# EAGLE design AOXIM_V1.1 (EAGLE 8.7.0)
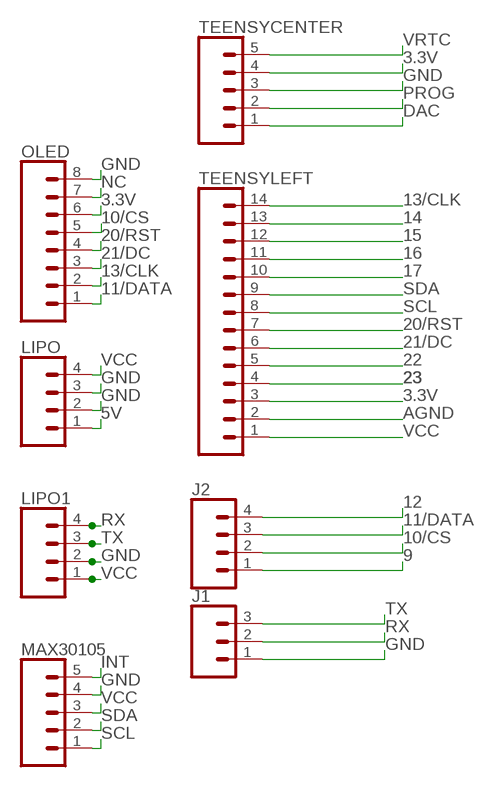
[diagram p0: schematic, sheet 1]

## Parts
J1  CONN_03  [1X03]
J2  CONN_04  [1X04]
LIPO  CONN_04  [1X04]
LIPO1  CONN_04  [1X04]
MAX30105  CONN_05  [1X05]
OLED  CONN_08"  [1X08]
TEENSYCENTER  CONN_05  [1X05]
TEENSYLEFT  CONN_14  [1X14]

## Nets
3.3V: OLED.6 TEENSYCENTER.4 TEENSYLEFT.3
5V: LIPO.1
9: J2.1
10/CS: J2.2 OLED.5
11/DATA: J2.3 OLED.1
12: J2.4
13/CLK: OLED.2 TEENSYLEFT.14
14: TEENSYLEFT.13
15: TEENSYLEFT.12
16: TEENSYLEFT.11
17: TEENSYLEFT.10
20/RST: OLED.4 TEENSYLEFT.7
21/DC: OLED.3 TEENSYLEFT.6
22: TEENSYLEFT.5
23: TEENSYLEFT.4
AGND: TEENSYLEFT.2
DAC: TEENSYCENTER.1
GND: J1.1 LIPO1.2 LIPO.2 LIPO.3 MAX30105.4 OLED.8 TEENSYCENTER.3
INT: MAX30105.5
NC: OLED.7
PROG: TEENSYCENTER.2
RX: J1.2 LIPO1.4
SCL: MAX30105.1 TEENSYLEFT.8
SDA: MAX30105.2 TEENSYLEFT.9
TX: J1.3 LIPO1.3
VCC: LIPO1.1 LIPO.4 MAX30105.3 TEENSYLEFT.1
VRTC: TEENSYCENTER.5

## Library data of the parts
J1 = SparkFun-Connectors:CONN_03: Multi connection point. Often used as Generic Header-pin footprint for 0.1 inch spaced/style header connections On any of the 0.1 inch spaced packages, you can populate with these: Break Away Headers - Straight <https://www.sparkfun.com/products/116> (PRT-00116) Break Away Male Headers - Right Angle <https://www.sparkfun.com/products/553> (PRT-00553) Female Headers <https://www.sparkfun.com/products/115> (PRT-00115) Break Away Headers - Machine Pin <https://www.sparkfun.com/products/117> (PRT-00117) Break Away Female Headers - Swiss Machine Pin <https://www.sparkfun.com/products/743> (PRT-00743) Stackable Header - 3 Pin (Female, 0.1") <https://www.sparkfun.com/products/13875> (PRT-13875) For SCREWTERMINALS and SPRING TERMINALS visit here: Screw Terimnals on SparkFun.com <https://www.sparkfun.com/search/results?term=Screw+Terminals> (5mm/3.5mm/2.54mm spacing) This device is also useful as a general connection point to wire up your design to another part of your project. Our various solder wires solder well into these plated through hole pads. Hook-Up Wire - Assortment (Stranded, 22 AWG) <https://www.sparkfun.com/products/11375> (PRT-11375) Hook-Up Wire - Assortment (Solid Core, 22 AWG) <https://www.sparkfun.com/products/11367> (PRT-11367) View the entire wire category on our website here <https://www.sparkfun.com/categories/141> Special notes: Molex polarized connector foot print use with SKU : PRT-08232 with associated crimp pins and housings.
J2 LIPO LIPO1 = SparkFun-Connectors:CONN_04: Multi connection point. Often used as Generic Header-pin footprint for 0.1 inch spaced/style header connections On any of the 0.1 inch spaced packages, you can populate with these: Break Away Headers - Straight <https://www.sparkfun.com/products/116> (PRT-00116) Break Away Male Headers - Right Angle <https://www.sparkfun.com/products/553> (PRT-00553) Female Headers <https://www.sparkfun.com/products/115> (PRT-00115) Break Away Headers - Machine Pin <https://www.sparkfun.com/products/117> (PRT-00117) Break Away Female Headers - Swiss Machine Pin <https://www.sparkfun.com/products/743> (PRT-00743) For SCREWTERMINALS and SPRING TERMINALS visit here: Screw Terimnals on SparkFun.com <https://www.sparkfun.com/search/results?term=Screw+Terminals> (5mm/3.5mm/2.54mm spacing) This device is also useful as a general connection point to wire up your design to another part of your project. Our various solder wires solder well into these plated through hole pads. Hook-Up Wire - Assortment (Stranded, 22 AWG) <https://www.sparkfun.com/products/11375> (PRT-11375) Hook-Up Wire - Assortment (Solid Core, 22 AWG) <https://www.sparkfun.com/products/11367> (PRT-11367) View the entire wire category on our website here <https://www.sparkfun.com/categories/141> Special notes: Molex polarized connector foot print use with SKU : PRT-08231 with associated crimp pins and housings. 1MM SMD Version SKU: PRT-10208; PROD_ID: CONN-09696
MAX30105 TEENSYCENTER = SparkFun-Connectors:CONN_05: Multi connection point. Often used as Generic Header-pin footprint for 0.1 inch spaced/style header connections On any of the 0.1 inch spaced packages, you can populate with these: Break Away Headers - Straight <https://www.sparkfun.com/products/116> (PRT-00116) Break Away Male Headers - Right Angle <https://www.sparkfun.com/products/553> (PRT-00553) Female Headers <https://www.sparkfun.com/products/115> (PRT-00115) Break Away Headers - Machine Pin <https://www.sparkfun.com/products/117> (PRT-00117) Break Away Female Headers - Swiss Machine Pin <https://www.sparkfun.com/products/743> (PRT-00743) For SCREWTERMINALS and SPRING TERMINALS visit here: Screw Terimnals on SparkFun.com <https://www.sparkfun.com/search/results?term=Screw+Terminals> (5mm/3.5mm/2.54mm spacing) This device is also useful as a general connection point to wire up your design to another part of your project. Our various solder wires solder well into these plated through hole pads. Hook-Up Wire - Assortment (Stranded, 22 AWG) <https://www.sparkfun.com/products/11375> (PRT-11375) Hook-Up Wire - Assortment (Solid Core, 22 AWG) <https://www.sparkfun.com/products/11367> (PRT-11367) View the entire wire category on our website here <https://www.sparkfun.com/categories/141> Special notes: Molex polarized connector foot print use with SKU : PRT-08231 with associated crimp pins and housings. 1MM SMD Version SKU: PRT-10208
OLED = SparkFun-Connectors:CONN_08: Multi connection point. Often used as Generic Header-pin footprint for 0.1 inch spaced/style header connections On any of the 0.1 inch spaced packages, you can populate with these: Break Away Headers - Straight <https://www.sparkfun.com/products/116> (PRT-00116) Break Away Male Headers - Right Angle <https://www.sparkfun.com/products/553> (PRT-00553) Female Headers <https://www.sparkfun.com/products/115> (PRT-00115) Break Away Headers - Machine Pin <https://www.sparkfun.com/products/117> (PRT-00117) Break Away Female Headers - Swiss Machine Pin <https://www.sparkfun.com/products/743> (PRT-00743) Arduino Stackable Header - 8 Pin <https://www.sparkfun.com/products/9279> (PRT-09279) For SCREWTERMINALS and SPRING TERMINALS visit here: Screw Terimnals on SparkFun.com <https://www.sparkfun.com/search/results?term=Screw+Terminals> (5mm/3.5mm/2.54mm spacing) This device is also useful as a general connection point to wire up your design to another part of your project. Our various solder wires solder well into these plated through hole pads. Hook-Up Wire - Assortment (Stranded, 22 AWG) <https://www.sparkfun.com/products/11375> (PRT-11375) Hook-Up Wire - Assortment (Solid Core, 22 AWG) <https://www.sparkfun.com/products/11367> (PRT-11367) View the entire wire category on our website here <https://www.sparkfun.com/categories/141> Special notes: Molex polarized connector foot print use with SKU : PRT-08231 with associated crimp pins and housings. 1MM SMD Version SKU: PRT-10208 NOTES ON THE VARIANTS LOCK and LOCK_LONGPADS... This footprint was designed to help hold the alignment of a through-hole component (i.e. 6-pin header) while soldering it into place. You may notice that each hole has been shifted either up or down by 0.005 of an inch from it's more standard position (which is a perfectly straight line). This slight alteration caused the pins (the squares in the middle) to touch the edges of the holes. Because they are alternating, it causes a "brace" to hold the component in place. 0.005 has proven to be the perfect amount of "off-center" position when using our standard breakaway headers. Although looks a little odd when you look at the bare footprint, once you have a header in there, the alteration is very hard to notice. Also,if you push a header all the way into place, it is covered up entirely on the bottom side.; PROD_ID: CONN-08438
TEENSYLEFT = SparkFun-Connectors:CONN_14: Multi connection point. Often used as Generic Header-pin footprint for 0.1 inch spaced/style header connections On any of the 0.1 inch spaced packages, you can populate with these: Break Away Headers - Straight <https://www.sparkfun.com/products/116> (PRT-00116) Break Away Male Headers - Right Angle <https://www.sparkfun.com/products/553> (PRT-00553) Female Headers <https://www.sparkfun.com/products/115> (PRT-00115) Break Away Headers - Machine Pin <https://www.sparkfun.com/products/117> (PRT-00117) Break Away Female Headers - Swiss Machine Pin <https://www.sparkfun.com/products/743> (PRT-00743) For SCREWTERMINALS and SPRING TERMINALS visit here: Screw Terimnals on SparkFun.com <https://www.sparkfun.com/search/results?term=Screw+Terminals> (5mm/3.5mm/2.54mm spacing) This device is also useful as a general connection point to wire up your design to another part of your project. Our various solder wires solder well into these plated through hole pads. Hook-Up Wire - Assortment (Stranded, 22 AWG) <https://www.sparkfun.com/products/11375> (PRT-11375) Hook-Up Wire - Assortment (Solid Core, 22 AWG) <https://www.sparkfun.com/products/11367> (PRT-11367) View the entire wire category on our website here <https://www.sparkfun.com/categories/141> Special notes: Molex polarized connector foot print use with SKU : PRT-08231 with associated crimp pins and housings. 1MM SMD Version SKU: PRT-10208 NOTES ON THE VARIANTS LOCK and LOCK_LONGPADS... This footprint was designed to help hold the alignment of a through-hole component (i.e. 6-pin header) while soldering it into place. You may notice that each hole has been shifted either up or down by 0.005 of an inch from it's more standard position (which is a perfectly straight line). This slight alteration caused the pins (the squares in the middle) to touch the edges of the holes. Because they are alternating, it causes a "brace" to hold the component in place. 0.005 has proven to be the perfect amount of "off-center" position when using our standard breakaway headers. Although looks a little odd when you look at the bare footprint, once you have a header in there, the alteration is very hard to notice. Also,if you push a header all the way into place, it is covered up entirely on the bottom side.

## Net classes
0 default: width 0.406 mm, drill 0.203 mm, clearance 0.305 mm
1 power: width 0.203 mm

## Board
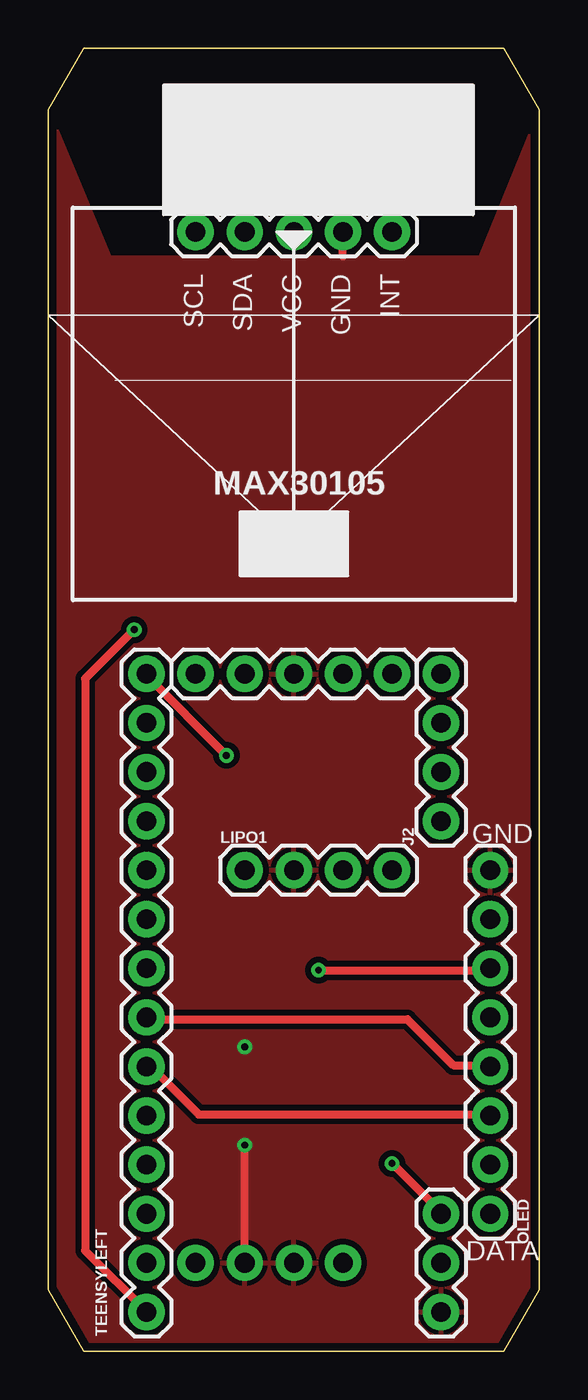
[diagram p1: board, top side]
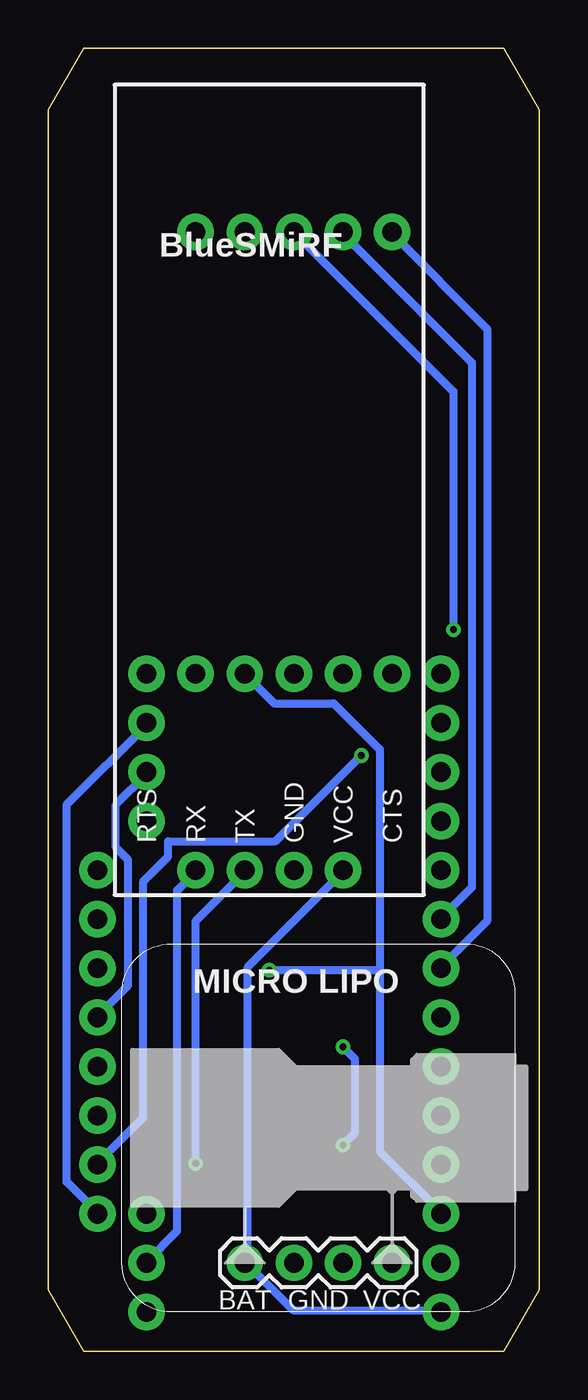
[diagram p2: board, bottom side, seen from below]

Size 25.4 x 67.42 mm. Coordinates in mm from the lower left corner, seen from the top.
Outline: 23.57,67.42 25.4,64.25 25.4,3.17 23.57,0 1.83,0 0,3.17 0,64.25 1.83,67.42 23.57,67.42
Copper layers (1*16): Top 0.035mm / dielectric 1.5mm / Bottom 0.035mm
Design rules "default *": minimum track width 6mil, minimum drill 0.35mm, track to track 6mil, track to pad 6mil, pad to pad 6mil, via to via 6mil, smd to smd 6mil, copper to edge 16mil, drill to drill 6mil, minimum pad ring 10mil, minimum via ring 8mil, stop-mask expansion 4mil, vias tented up to drill 0mil, thermal gap 10mil

### Footprints (pad centres in the part's own frame; a part is rotated, then mirrored left to right if it is on the bottom)
1X03 = drill 1.016 pad 1.88: 1 0,0; 2 2.54,0; 3 5.08,0
1X04 = drill 1.016 pad 1.88: 1 0,0; 2 2.54,0; 3 5.08,0; 4 7.62,0
1X05 = drill 1.016 pad 1.88: 1 0,0; 2 2.54,0; 3 5.08,0; 4 7.62,0; 5 10.16,0
1X08 = drill 1.016 pad 1.88: 1 0,0; 2 2.54,0; 3 5.08,0; 4 7.62,0; 5 10.16,0; 6 12.7,0; 7 15.24,0; 8 17.78,0
1X14 = drill 1.016 pad 1.88: 1 0,0; 2 2.54,0; 3 5.08,0; 4 7.62,0; 5 10.16,0; 6 12.7,0; 7 15.24,0; 8 17.78,0; 9 20.32,0; 10 22.86,0; 11 25.4,0; 12 27.94,0; 13 30.48,0; 14 33.02,0

### Placement (x,y rotation side)
J1  20.32,2.03 90 top
J2  20.32,27.43 90 top
LIPO  7.62,4.57 180 bottom
LIPO1  10.16,24.89 0 top
MAX30105  7.62,57.91 0 top
OLED  22.86,7.11 90 top
TEENSYCENTER  7.62,35.05 0 top
TEENSYLEFT  5.08,2.03 90 top

### Tracks (layer width: path | path; a pad name or v marks a point on that pad's centre or on a via)
3.3V  (via drill 0.35)
  Top 0.406: v13.97,19.72 22.86,19.72 OLED.6
  Bottom 0.406: 8.25,19.72 8.25,31.15 10.64,33.53 13.72,33.53 TEENSYCENTER.4 | 8.25,19.72 8.25,10.35 5.08,7.17 TEENSYLEFT.3 | 8.25,19.72 v13.97,19.72
10/CS
  Bottom 0.406: J2.2 20.32,29.88 21.91,28.29 21.91,26.07 21.27,25.43 21.27,18.92 22.86,17.34 OLED.5
11/DATA
  Bottom 0.406: J2.3 20.32,32.42 24.45,28.29 24.45,8.76 22.86,7.17 OLED.1
13/CLK  (via drill 0.35)
  Top 0.406: v9.21,30.83 5.08,34.96 TEENSYLEFT.14
  Bottom 0.406: v9.21,30.83 13.65,26.38 19.21,26.38 19.21,25.59 20.48,24.32 20.48,12.1 22.86,9.72 OLED.2
20/RST
  Top 0.406: OLED.4 22.86,14.8 20.95,14.8 18.57,17.18 5.08,17.18 TEENSYLEFT.7
21/DC
  Top 0.406: OLED.3 22.86,12.26 7.78,12.26 5.4,14.64 5.08,14.64 TEENSYLEFT.6
GND  (via drill 0.35)
  Top 0.406: 15.24,56.64 MAX30105.4 | LIPO.2 v10.16,10.67
  Bottom 0.406: v10.16,10.67 9.52,11.3 9.52,15.11 v10.16,15.75
  pour Top: 1.9,-0.13 -0.13,3.3 0,64.26 3.17,56.64 22.35,56.64 25.4,64.14 25.4,3.17 23.62,0
RX
  Bottom 0.406: LIPO1.4 17.78,24.8 18.73,23.84 18.73,6.22 20.32,4.64 J1.2
SCL
  Bottom 0.406: TEENSYLEFT.8 5.08,19.88 2.7,22.26 2.7,52.9 7.62,57.82 MAX30105.1
SDA
  Bottom 0.406: TEENSYLEFT.9 5.08,22.42 3.49,24 3.49,51.15 10.16,57.82 MAX30105.2
TX  (via drill 0.35)
  Top 0.406: v17.78,9.72 20.32,7.17 J1.3
  Bottom 0.406: v17.78,9.72 17.78,22.26 15.24,24.8 LIPO1.3
VCC  (via drill 0.35)
  Top 0.406: v4.44,37.34 1.9,34.8 1.9,5.21 TEENSYLEFT.1
  Bottom 0.406: TEENSYLEFT.1 5.08,2.1 12.7,2.1 15.18,4.57 LIPO.4 15.08,4.64 15.08,19.88 10.16,24.8 LIPO1.1 | MAX30105.3 4.44,49.66 v4.44,37.34

### Text on the board
tPlace: SCL | SDA | VCC | GND | INT | MAX30105 | GND | DATA
bPlace: BlueSMiRF | CTS | VCC | GND | TX | RX | RTS | MICRO LIPO | VCC | GND | BAT
Measures: Clears 4-40 Screw | All Dimensions in Inches